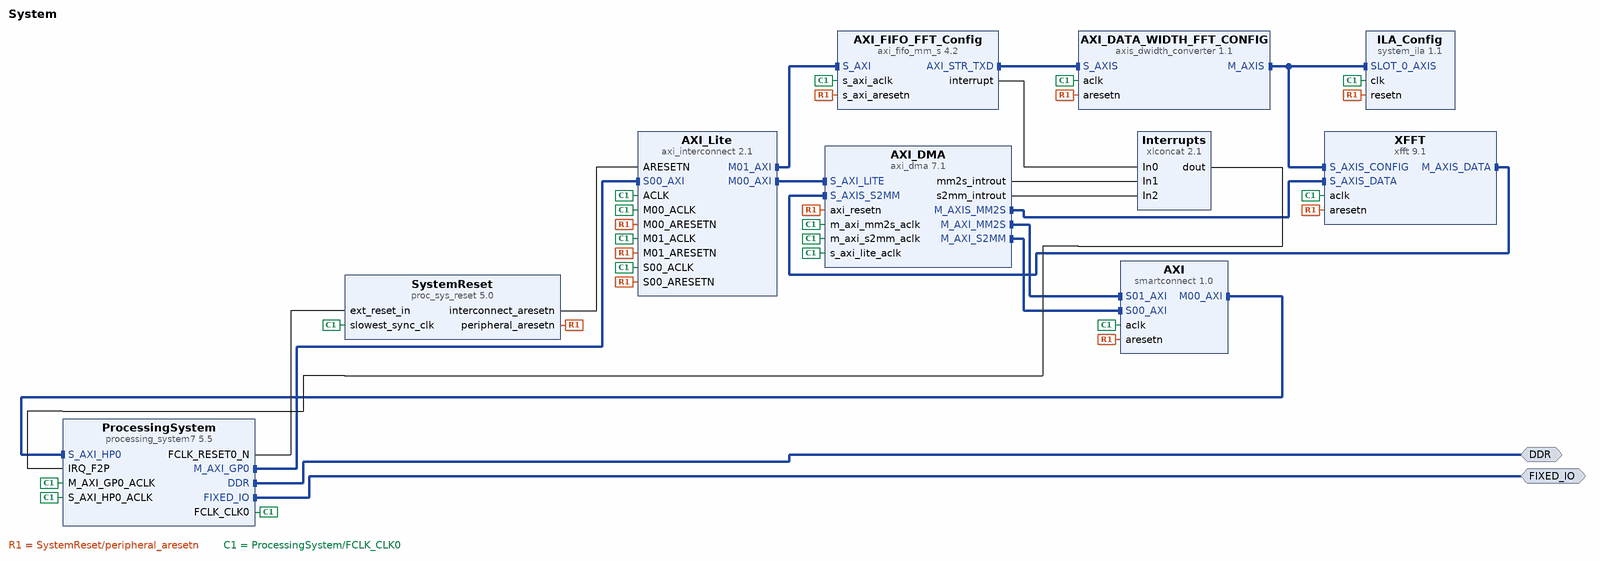
[diagram p0: block diagram of the top level]
# Vivado block design System, xc7z010clg400-1, Vivado 2020.2
create_bd_design System

create_bd_intf_port -mode Master -vlnv xilinx.com:display_processing_system7:fixedio_rtl:1.0 FIXED_IO
create_bd_intf_port -mode Master -vlnv xilinx.com:interface:ddrx_rtl:1.0 DDR

create_bd_cell -type ip -vlnv xilinx.com:ip:processing_system7:5.5 ProcessingSystem
set_property -dict [list \
  CONFIG.PCW_APU_PERIPHERAL_FREQMHZ 650.000000 \
  CONFIG.PCW_CRYSTAL_PERIPHERAL_FREQMHZ 50.000000 \
  CONFIG.PCW_ENET0_PERIPHERAL_ENABLE 0 \
  CONFIG.PCW_FCLK1_PERIPHERAL_CLKSRC {DDR PLL} \
  CONFIG.PCW_FCLK2_PERIPHERAL_CLKSRC {ARM PLL} \
  CONFIG.PCW_FPGA0_PERIPHERAL_FREQMHZ 100.000000 \
  CONFIG.PCW_FPGA1_PERIPHERAL_FREQMHZ 175.000000 \
  CONFIG.PCW_FPGA2_PERIPHERAL_FREQMHZ 12.288000 \
  CONFIG.PCW_FPGA3_PERIPHERAL_FREQMHZ 100.000000 \
  CONFIG.PCW_GP0_EN_MODIFIABLE_TXN 0 \
  CONFIG.PCW_GP1_EN_MODIFIABLE_TXN 0 \
  CONFIG.PCW_GPIO_MIO_GPIO_ENABLE 0 \
  CONFIG.PCW_GPIO_PERIPHERAL_ENABLE 1 \
  CONFIG.PCW_IMPORT_BOARD_PRESET /home/daniel/Schreibtisch/Git/Zybo/Misc/Zybo.xml \
  CONFIG.PCW_IRQ_F2P_INTR 1 \
  CONFIG.PCW_PERIPHERAL_BOARD_PRESET part0 \
  CONFIG.PCW_PRESET_BANK1_VOLTAGE {LVCMOS 1.8V} \
  CONFIG.PCW_QSPI_PERIPHERAL_ENABLE 0 \
  CONFIG.PCW_SD0_PERIPHERAL_ENABLE 0 \
  CONFIG.PCW_UART1_PERIPHERAL_ENABLE 1 \
  CONFIG.PCW_UART1_UART1_IO {MIO 48 .. 49} \
  CONFIG.PCW_UART_PERIPHERAL_FREQMHZ 50 \
  CONFIG.PCW_UIPARAM_DDR_FREQ_MHZ 525.000000 \
  CONFIG.PCW_UIPARAM_DDR_PARTNO {MT41K128M16 JT-125} \
  CONFIG.PCW_USB0_PERIPHERAL_ENABLE 0 \
  CONFIG.PCW_USE_FABRIC_INTERRUPT 1 \
  CONFIG.PCW_USE_S_AXI_HP0 1 \
  CONFIG.preset None \
] [get_bd_cells ProcessingSystem]
# 339 more settings of ProcessingSystem are not shown: defaults, MIO pin electricals, DDR timing, and values the tool derives
create_bd_cell -type ip -vlnv xilinx.com:ip:proc_sys_reset:5.0 SystemReset
create_bd_cell -type ip -vlnv xilinx.com:ip:axi_dma:7.1 AXI_DMA
set_property -dict [list \
  CONFIG.c_include_mm2s 1 \
  CONFIG.c_include_mm2s_dre 0 \
  CONFIG.c_include_s2mm 1 \
  CONFIG.c_include_s2mm_dre 0 \
  CONFIG.c_include_sg 0 \
  CONFIG.c_m_axi_mm2s_data_width 64 \
  CONFIG.c_m_axis_mm2s_tdata_width 64 \
  CONFIG.c_mm2s_burst_size 8 \
  CONFIG.c_s2mm_burst_size 16 \
  CONFIG.c_sg_length_width 26 \
] [get_bd_cells AXI_DMA]
create_bd_cell -type ip -vlnv xilinx.com:ip:axi_fifo_mm_s:4.2 AXI_FIFO_FFT_Config
set_property -dict {CONFIG.C_USE_RX_DATA 0 CONFIG.C_USE_TX_CTRL 0} [get_bd_cells AXI_FIFO_FFT_Config]
create_bd_cell -type ip -vlnv xilinx.com:ip:smartconnect:1.0 AXI
set_property -dict {CONFIG.NUM_SI 2} [get_bd_cells AXI]
create_bd_cell -type ip -vlnv xilinx.com:ip:axis_dwidth_converter:1.1 AXI_DATA_WIDTH_FFT_CONFIG
set_property -dict {CONFIG.HAS_MI_TKEEP 0 CONFIG.M_TDATA_NUM_BYTES 2} [get_bd_cells AXI_DATA_WIDTH_FFT_CONFIG]
create_bd_cell -type ip -vlnv xilinx.com:ip:axi_interconnect:2.1 AXI_Lite
set_property -dict {CONFIG.NUM_MI 2 CONFIG.SYNCHRONIZATION_STAGES 2} [get_bd_cells AXI_Lite]
create_bd_cell -type ip -vlnv xilinx.com:ip:system_ila:1.1 ILA_Config
set_property -dict [list \
  CONFIG.C_MON_TYPE INTERFACE \
  CONFIG.C_NUM_MONITOR_SLOTS 1 \
  CONFIG.C_SLOT_0_APC_EN 0 \
  CONFIG.C_SLOT_0_AXI_DATA_SEL 1 \
  CONFIG.C_SLOT_0_AXI_TRIG_SEL 1 \
  CONFIG.C_SLOT_0_INTF_TYPE xilinx.com:interface:axis_rtl:1.0 \
] [get_bd_cells ILA_Config]
create_bd_cell -type ip -vlnv xilinx.com:ip:xfft:9.1 XFFT
set_property -dict [list \
  CONFIG.aresetn true \
  CONFIG.data_format floating_point \
  CONFIG.implementation_options pipelined_streaming_io \
  CONFIG.number_of_stages_using_block_ram_for_data_and_phase_factors 0 \
  CONFIG.output_ordering natural_order \
  CONFIG.phase_factor_width 24 \
  CONFIG.run_time_configurable_transform_length true \
  CONFIG.scaling_options scaled \
  CONFIG.transform_length 64 \
] [get_bd_cells XFFT]
create_bd_cell -type ip -vlnv xilinx.com:ip:xlconcat:2.1 Interrupts
set_property -dict {CONFIG.NUM_PORTS 3 CONFIG.dout_width 3} [get_bd_cells Interrupts]

# ---- connections ----

connect_bd_intf_net [get_bd_intf_pins AXI_DMA/M_AXI_MM2S] [get_bd_intf_pins AXI/S01_AXI]
connect_bd_intf_net -intf_net Processing_System_0_DDR [get_bd_intf_ports DDR] [get_bd_intf_pins ProcessingSystem/DDR]
connect_bd_intf_net [get_bd_intf_pins AXI_Lite/M00_AXI] [get_bd_intf_pins AXI_DMA/S_AXI_LITE]
connect_bd_intf_net [get_bd_intf_pins AXI_DMA/M_AXI_S2MM] [get_bd_intf_pins AXI/S00_AXI]
connect_bd_intf_net [get_bd_intf_pins AXI_Lite/M01_AXI] [get_bd_intf_pins AXI_FIFO_FFT_Config/S_AXI]
connect_bd_intf_net -intf_net AXI_DATA_WIDTH_FFT_CONFIG_M_AXIS [get_bd_intf_pins AXI_DATA_WIDTH_FFT_CONFIG/M_AXIS] [get_bd_intf_pins XFFT/S_AXIS_CONFIG]
connect_bd_intf_net [get_bd_intf_pins AXI_DATA_WIDTH_FFT_CONFIG/M_AXIS] [get_bd_intf_pins ILA_Config/SLOT_0_AXIS]
connect_bd_intf_net -intf_net Processing_System_0_M_AXI_GP0 [get_bd_intf_pins ProcessingSystem/M_AXI_GP0] [get_bd_intf_pins AXI_Lite/S00_AXI]
connect_bd_intf_net [get_bd_intf_pins XFFT/S_AXIS_DATA] [get_bd_intf_pins AXI_DMA/M_AXIS_MM2S]
connect_bd_intf_net [get_bd_intf_pins AXI_DMA/S_AXIS_S2MM] [get_bd_intf_pins XFFT/M_AXIS_DATA]
connect_bd_intf_net [get_bd_intf_pins AXI_DATA_WIDTH_FFT_CONFIG/S_AXIS] [get_bd_intf_pins AXI_FIFO_FFT_Config/AXI_STR_TXD]
connect_bd_intf_net -intf_net processing_system7_0_FIXED_IO [get_bd_intf_ports FIXED_IO] [get_bd_intf_pins ProcessingSystem/FIXED_IO]
connect_bd_intf_net -intf_net axi_smc_M00_AXI [get_bd_intf_pins AXI/M00_AXI] [get_bd_intf_pins ProcessingSystem/S_AXI_HP0]
connect_bd_net -net rst_processing_system7_0_100M_peripheral_aresetn [get_bd_pins SystemReset/peripheral_aresetn] \
  [get_bd_pins AXI_DMA/axi_resetn] [get_bd_pins AXI_FIFO_FFT_Config/s_axi_aresetn] [get_bd_pins AXI/aresetn] \
  [get_bd_pins AXI_DATA_WIDTH_FFT_CONFIG/aresetn] [get_bd_pins AXI_Lite/S00_ARESETN] [get_bd_pins AXI_Lite/M00_ARESETN] \
  [get_bd_pins AXI_Lite/M01_ARESETN] [get_bd_pins ILA_Config/resetn] [get_bd_pins XFFT/aresetn]
connect_bd_net -net processing_system7_0_FCLK_CLK0 [get_bd_pins ProcessingSystem/FCLK_CLK0] \
  [get_bd_pins ProcessingSystem/M_AXI_GP0_ACLK] [get_bd_pins ProcessingSystem/S_AXI_HP0_ACLK] \
  [get_bd_pins SystemReset/slowest_sync_clk] [get_bd_pins AXI_DMA/s_axi_lite_aclk] [get_bd_pins AXI_DMA/m_axi_mm2s_aclk] \
  [get_bd_pins AXI_DMA/m_axi_s2mm_aclk] [get_bd_pins AXI_FIFO_FFT_Config/s_axi_aclk] [get_bd_pins AXI/aclk] \
  [get_bd_pins AXI_DATA_WIDTH_FFT_CONFIG/aclk] [get_bd_pins AXI_Lite/ACLK] [get_bd_pins AXI_Lite/S00_ACLK] \
  [get_bd_pins AXI_Lite/M00_ACLK] [get_bd_pins AXI_Lite/M01_ACLK] [get_bd_pins ILA_Config/clk] [get_bd_pins XFFT/aclk]
connect_bd_net -net rst_processing_system7_0_100M_interconnect_aresetn [get_bd_pins SystemReset/interconnect_aresetn] [get_bd_pins AXI_Lite/ARESETN]
connect_bd_net -net xlconcat_0_dout [get_bd_pins Interrupts/dout] [get_bd_pins ProcessingSystem/IRQ_F2P]
connect_bd_net [get_bd_pins AXI_FIFO_FFT_Config/interrupt] [get_bd_pins Interrupts/In0]
connect_bd_net [get_bd_pins AXI_DMA/mm2s_introut] [get_bd_pins Interrupts/In1]
connect_bd_net [get_bd_pins AXI_DMA/s2mm_introut] [get_bd_pins Interrupts/In2]
connect_bd_net [get_bd_pins ProcessingSystem/FCLK_RESET0_N] [get_bd_pins SystemReset/ext_reset_in]
set_property HDL_ATTRIBUTE.DEBUG true [get_bd_intf_nets AXI_DATA_WIDTH_FFT_CONFIG_M_AXIS]
set_property HDL_ATTRIBUTE.MARK_DEBUG true [get_bd_intf_nets AXI_DATA_WIDTH_FFT_CONFIG_M_AXIS]

# ---- address map ----
assign_bd_address -offset 0x00000000 -range 512M -target_address_space [get_bd_addr_spaces AXI_DMA/Data_MM2S] [get_bd_addr_segs ProcessingSystem/S_AXI_HP0/HP0_DDR_LOWOCM]
assign_bd_address -offset 0x00000000 -range 512M -target_address_space [get_bd_addr_spaces AXI_DMA/Data_S2MM] [get_bd_addr_segs ProcessingSystem/S_AXI_HP0/HP0_DDR_LOWOCM]
assign_bd_address -offset 0x40400000 -range 64K -target_address_space [get_bd_addr_spaces ProcessingSystem/Data] [get_bd_addr_segs AXI_DMA/S_AXI_LITE/Reg]
assign_bd_address -offset 0x43C10000 -range 64K -target_address_space [get_bd_addr_spaces ProcessingSystem/Data] [get_bd_addr_segs AXI_FIFO_FFT_Config/S_AXI/Mem0]

validate_bd_design
save_bd_design
